# EAGLE schematic peephole (EAGLE 6.5.0)
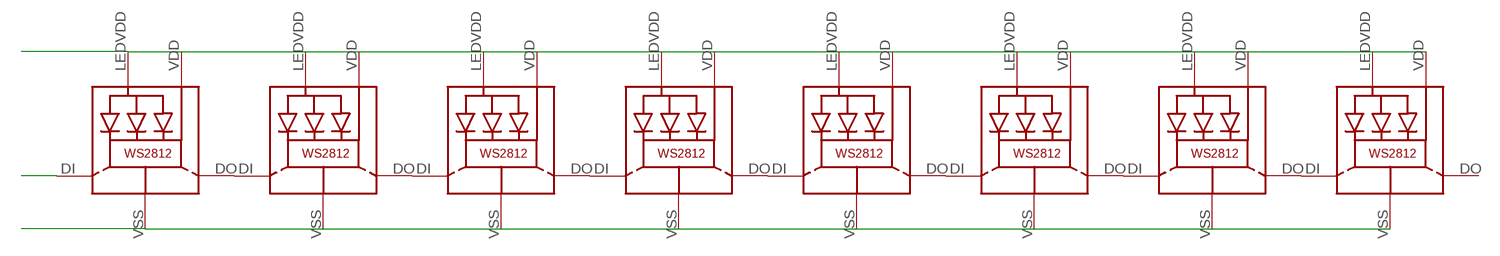
[diagram p0: schematic, sheet 1]

## Parts
LED1  WS2812  [WS2812]
LED2  WS2812  [WS2812]
LED3  WS2812  [WS2812]
LED4  WS2812  [WS2812]
LED5  WS2812  [WS2812]
LED6  WS2812  [WS2812]
LED7  WS2812  [WS2812]
LED8  WS2812  [WS2812]

## Nets
DATA: LED1.DI
GND: LED1.VSS(GND) LED2.VSS(GND) LED3.VSS(GND) LED4.VSS(GND) LED5.VSS(GND) LED6.VSS(GND) LED7.VSS(GND) LED8.VSS(GND)
N$1: LED5.DO LED6.DI
N$2: LED6.DO LED7.DI
N$3: LED7.DO LED8.DI
N$4: LED4.DO LED5.DI
N$5: LED3.DO LED4.DI
N$6: LED2.DO LED3.DI
N$7: LED1.DO LED2.DI
VDD: LED1.LEDVDD LED1.VDD LED2.LEDVDD LED2.VDD LED3.LEDVDD LED3.VDD LED4.LEDVDD LED4.VDD LED5.LEDVDD LED5.VDD LED6.LEDVDD LED6.VDD LED7.LEDVDD LED7.VDD LED8.LEDVDD LED8.VDD
Unconnected: LED8.DO

## Library data of the parts
LED1-LED8 = adafruit:WS2812